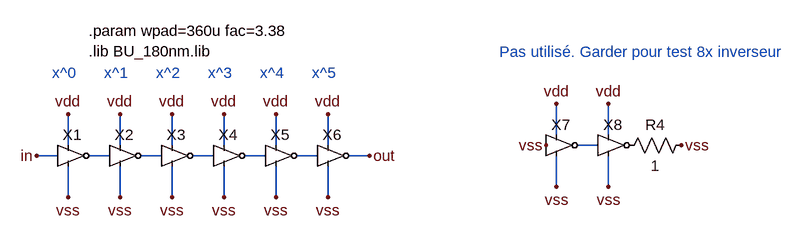
[diagram p0: schematic pad_buffer.asc]
pad_buffer.asc, the LTspice schematic file:
Version 4
SHEET 1 1556 680
WIRE 1152 448 1152 400
WIRE 1232 448 1232 400
WIRE 400 464 400 416
WIRE 480 464 480 416
WIRE 560 464 560 416
WIRE 640 464 640 416
WIRE 720 464 720 416
WIRE 800 464 800 416
WIRE 1216 464 1184 464
WIRE 384 480 352 480
WIRE 464 480 432 480
WIRE 544 480 512 480
WIRE 624 480 592 480
WIRE 704 480 672 480
WIRE 784 480 752 480
WIRE 864 480 832 480
WIRE 1152 528 1152 480
WIRE 1232 528 1232 480
WIRE 400 544 400 496
WIRE 480 544 480 496
WIRE 560 544 560 496
WIRE 640 544 640 496
WIRE 720 544 720 496
WIRE 800 544 800 496
FLAG 400 416 vdd
FLAG 352 480 in
FLAG 864 480 out
FLAG 400 544 vss
FLAG 480 416 vdd
FLAG 560 416 vdd
FLAG 640 416 vdd
FLAG 720 416 vdd
FLAG 800 416 vdd
FLAG 480 544 vss
FLAG 560 544 vss
FLAG 640 544 vss
FLAG 720 544 vss
FLAG 800 544 vss
FLAG 1152 528 vss
FLAG 1232 528 vss
FLAG 1152 400 vdd
FLAG 1232 400 vdd
FLAG 1136 464 vss
FLAG 1344 464 vss
SYMBOL inv 400 480 R0
SYMATTR InstName X1
SYMATTR SpiceLine ll=180n wn={nnw} wp={nnw*mp}
SYMBOL inv 480 480 R0
SYMATTR InstName X2
SYMATTR SpiceLine ll=180n wn={nnw*fac} wp={nnw*mp*fac}
SYMBOL inv 560 480 R0
SYMATTR InstName X3
SYMATTR SpiceLine ll=180n wn={nnw*fac*fac} wp={nnw*mp*fac*fac}
SYMBOL inv 640 480 R0
SYMATTR InstName X4
SYMATTR SpiceLine ll=180n wn={nnw*fac*fac*fac} wp={nnw*mp*fac*fac*fac}
SYMBOL inv 720 480 R0
SYMATTR InstName X5
SYMATTR SpiceLine ll=180n wn={nnw*fac*fac*fac*fac} wp={nnw*mp*fac*fac*fac*fac}
SYMBOL inv 800 480 R0
SYMATTR InstName X6
SYMATTR SpiceLine ll=180n wn={nnw*fac*fac*fac*fac*fac} wp={nnw*mp*fac*fac*fac*fac*fac}
SYMBOL inv 1152 464 R0
SYMATTR InstName X7
SYMATTR SpiceLine ll=180n wn={nnw*fac*fac*fac*fac*fac*fac} wp={nnw*mp*fac*fac*fac*fac*fac*fac}
SYMBOL inv 1232 464 R0
SYMATTR InstName X8
SYMATTR SpiceLine ll=180n wn={nnw*fac*fac*fac*fac*fac*fac*fac} wp={nnw*mp*fac*fac*fac*fac*fac*fac*fac}
SYMBOL /res 1360 448 R90
WINDOW 0 0 56 VBottom 2
WINDOW 3 32 56 VTop 2
SYMATTR InstName R4
SYMATTR Value 1
TEXT 432 288 Left 2 !.param wpad=360u fac=3.38\n.lib BU_180nm.lib
TEXT 376 352 Left 2 ;x^0
TEXT 456 352 Left 2 ;x^1
TEXT 536 352 Left 2 ;x^2
TEXT 616 352 Left 2 ;x^3
TEXT 696 352 Left 2 ;x^4
TEXT 776 352 Left 2 ;x^5
TEXT 1064 320 Left 2 ;Pas utilisé. Garder pour test 8x inverseur

The netlist it stands for:
* pad_buffer.asc
XX1 in N002 vdd vss inv ll=180n wn={nnw} wp={nnw*mp}  ; pins In _Q vdd vss
XX2 N002 N003 vdd vss inv ll=180n wn={nnw*fac} wp={nnw*mp*fac}  ; pins In _Q vdd vss
XX3 N003 N004 vdd vss inv ll=180n wn={nnw*fac*fac} wp={nnw*mp*fac*fac}  ; pins In _Q vdd vss
XX4 N004 N005 vdd vss inv ll=180n wn={nnw*fac*fac*fac} wp={nnw*mp*fac*fac*fac}  ; pins In _Q vdd vss
XX5 N005 N006 vdd vss inv ll=180n wn={nnw*fac*fac*fac*fac} wp={nnw*mp*fac*fac*fac*fac}  ; pins In _Q vdd vss
XX6 N006 out vdd vss inv ll=180n wn={nnw*fac*fac*fac*fac*fac} wp={nnw*mp*fac*fac*fac*fac*fac}  ; pins In _Q vdd vss
XX7 vss N001 vdd vss inv ll=180n wn={nnw*fac*fac*fac*fac*fac*fac} wp={nnw*mp*fac*fac*fac*fac*fac*fac}  ; pins In _Q vdd vss
XX8 N001 P001 vdd vss inv ll=180n wn={nnw*fac*fac*fac*fac*fac*fac*fac} wp={nnw*mp*fac*fac*fac*fac*fac*fac*fac}  ; pins In _Q vdd vss
R4 vss P001 1
.param wpad=360u fac=3.38
.lib BU_180nm.lib
* x^0
* x^1
* x^2
* x^3
* x^4
* x^5
* Pas utilisé. Garder pour test 8x inverseur
.lib inv.asc
.backanno
.end